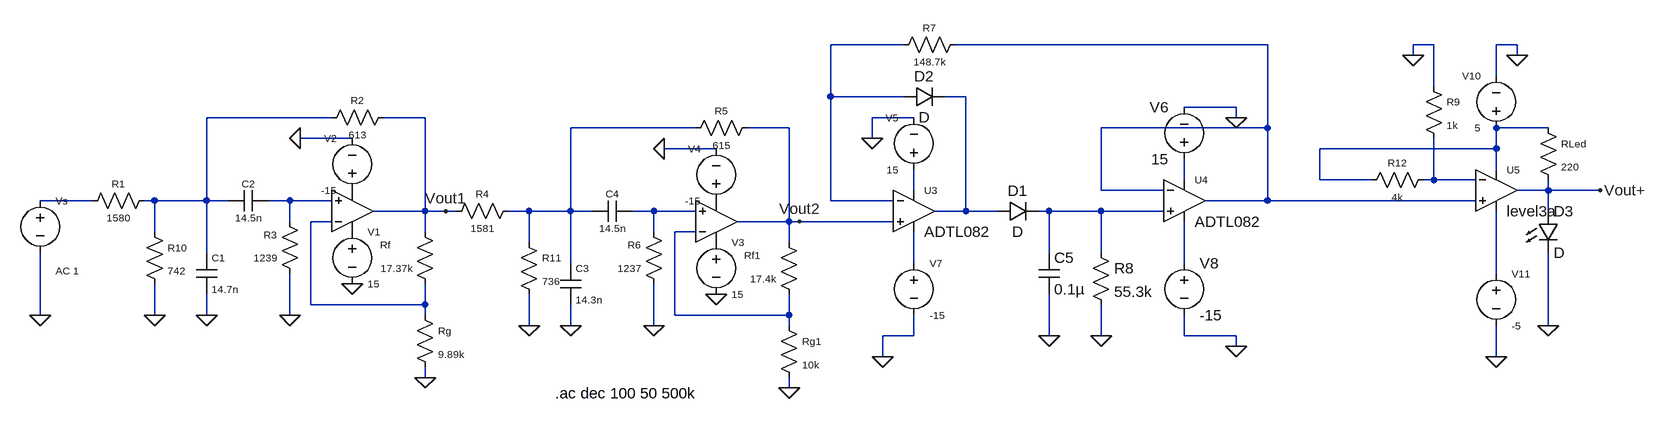
[diagram p0: schematic Bandpass Sallen Key lab 17kHz 2 stage with all stage vd fixed.asc]
Bandpass Sallen Key lab 17kHz 2 stage with all stage vd fixed.asc, the LTspice schematic file:
Version 4.1
SHEET 1 2168 980
WIRE 1008 -112 896 -112
WIRE 1568 -112 1088 -112
WIRE 1824 -112 1792 -112
WIRE 1952 -112 1920 -112
WIRE 1792 -96 1792 -112
WIRE 1952 -96 1952 -112
WIRE 1920 -64 1920 -112
WIRE 1824 -48 1824 -112
WIRE 896 -32 896 -112
WIRE 1008 -32 896 -32
WIRE 1104 -32 1072 -32
WIRE 1520 -16 1440 -16
WIRE 128 0 -64 0
WIRE 272 0 208 0
WIRE 1024 0 960 0
WIRE 1520 0 1520 -16
WIRE 688 16 496 16
WIRE 832 16 768 16
WIRE 1568 16 1568 -112
WIRE 1568 16 1312 16
WIRE 2000 16 1920 16
WIRE 160 32 80 32
WIRE 960 32 960 0
WIRE 720 48 640 48
WIRE 1920 48 1920 16
WIRE 1920 48 1648 48
WIRE 1920 80 1920 48
WIRE 1440 96 1440 64
WIRE 1648 96 1648 48
WIRE 1728 96 1648 96
WIRE 1824 96 1824 32
WIRE 1824 96 1808 96
WIRE 1888 96 1824 96
WIRE 1024 112 1024 80
WIRE 1312 112 1312 16
WIRE 1408 112 1312 112
WIRE 2000 112 2000 96
WIRE 2000 112 1952 112
WIRE 2080 112 2000 112
WIRE -240 128 -320 128
WIRE -144 128 -160 128
WIRE -64 128 -64 0
WIRE -64 128 -144 128
WIRE -32 128 -64 128
WIRE 64 128 32 128
WIRE 128 128 64 128
WIRE 896 128 896 -32
WIRE 992 128 896 128
WIRE 1568 128 1568 16
WIRE 1568 128 1472 128
WIRE 1888 128 1568 128
WIRE 272 144 272 0
WIRE 272 144 192 144
WIRE 304 144 272 144
WIRE 320 144 304 144
WIRE 432 144 400 144
WIRE 496 144 496 16
WIRE 496 144 432 144
WIRE 528 144 496 144
WIRE 624 144 592 144
WIRE 688 144 624 144
WIRE 1104 144 1104 -32
WIRE 1104 144 1056 144
WIRE 1152 144 1104 144
WIRE 1232 144 1216 144
WIRE 1312 144 1232 144
WIRE 1408 144 1312 144
WIRE 2000 144 2000 112
WIRE 64 160 64 128
WIRE 128 160 96 160
WIRE 832 160 832 16
WIRE 832 160 752 160
WIRE 848 160 832 160
WIRE 992 160 848 160
WIRE -144 176 -144 128
WIRE 272 176 272 144
WIRE 624 176 624 144
WIRE 688 176 656 176
WIRE 432 192 432 144
WIRE 832 192 832 160
WIRE -64 208 -64 128
WIRE 1232 208 1232 144
WIRE 1312 208 1312 144
WIRE 496 224 496 144
WIRE 1024 224 1024 176
WIRE 1440 224 1440 160
WIRE 1920 240 1920 144
WIRE 96 288 96 160
WIRE 272 288 272 256
WIRE 272 288 96 288
WIRE -320 304 -320 208
WIRE -144 304 -144 256
WIRE -64 304 -64 272
WIRE 64 304 64 240
WIRE 272 304 272 288
WIRE 656 304 656 176
WIRE 832 304 832 272
WIRE 832 304 656 304
WIRE 432 320 432 272
WIRE 496 320 496 288
WIRE 624 320 624 256
WIRE 832 320 832 304
WIRE 2000 320 2000 208
WIRE 1024 336 1024 304
WIRE 1024 336 976 336
WIRE 1232 336 1232 272
WIRE 1312 336 1312 288
WIRE 1440 336 1440 304
WIRE 1520 336 1440 336
WIRE 1520 352 1520 336
WIRE 976 368 976 336
WIRE 1920 368 1920 320
WIRE 272 400 272 384
WIRE 832 416 832 400
FLAG -64 304 0
FLAG 64 304 0
FLAG 272 400 0
FLAG -320 304 0
FLAG 304 144 Vout1
FLAG 160 256 0
FLAG 80 32 0
FLAG 496 320 0
FLAG 624 320 0
FLAG 832 416 0
FLAG 720 272 0
FLAG 640 48 0
FLAG 848 160 Vout2
FLAG -144 304 0
FLAG 432 320 0
FLAG 1232 336 0
FLAG 1312 336 0
FLAG 960 32 0
FLAG 976 368 0
FLAG 1520 0 0
FLAG 1520 352 0
FLAG 1792 -96 0
FLAG 1952 -96 0
FLAG 1920 368 0
FLAG 2000 320 0
FLAG 2080 112 Vout+
SYMBOL OpAmps\\UniversalOpAmp2 160 144 M180
WINDOW 0 16 -32 Invisible 1
SYMATTR InstName U1
SYMBOL res 224 -16 R90
WINDOW 0 0 56 VBottom 1
WINDOW 3 32 56 VTop 1
SYMATTR InstName R2
SYMATTR Value 613
SYMBOL res -144 112 R90
WINDOW 0 0 56 VBottom 1
WINDOW 3 32 56 VTop 1
SYMATTR InstName R1
SYMATTR Value 1580
SYMBOL res 80 256 R180
WINDOW 0 36 76 Left 1
WINDOW 3 36 40 Left 1
SYMATTR InstName R3
SYMATTR Value 1239
SYMBOL res 288 272 R180
WINDOW 0 85 76 Right 1
WINDOW 3 36 40 Left 1
SYMATTR InstName Rf
SYMATTR Value 17.37k
SYMBOL res 256 288 R0
WINDOW 0 36 40 Left 1
WINDOW 3 36 76 Left 1
SYMATTR InstName Rg
SYMATTR Value 9.89k
SYMBOL cap -80 208 R0
WINDOW 0 24 8 Left 1
WINDOW 3 24 56 Left 1
SYMATTR InstName C1
SYMATTR Value 14.7n
SYMBOL cap 32 112 R90
WINDOW 0 0 32 VBottom 1
WINDOW 3 32 32 VTop 1
SYMATTR InstName C2
SYMATTR Value 14.5n
SYMBOL voltage -320 112 R0
WINDOW 0 24 16 Left 1
WINDOW 123 24 124 Left 1
WINDOW 39 0 0 Left 0
SYMATTR InstName Vs
SYMATTR Value2 AC 1
SYMATTR Value ""
SYMBOL voltage 160 160 R0
WINDOW 0 24 16 Left 1
WINDOW 3 24 96 Left 1
WINDOW 123 0 0 Left 0
WINDOW 39 0 0 Left 0
SYMATTR InstName V1
SYMATTR Value 15
SYMBOL voltage 160 128 R180
WINDOW 0 24 96 Left 1
WINDOW 3 24 16 Left 1
WINDOW 123 0 0 Left 0
WINDOW 39 0 0 Left 0
SYMATTR InstName V2
SYMATTR Value -15
SYMBOL OpAmps\\UniversalOpAmp2 720 160 M180
WINDOW 0 16 -32 Invisible 1
SYMATTR InstName U2
SYMBOL res 416 128 R90
WINDOW 0 0 56 VBottom 1
WINDOW 3 32 56 VTop 1
SYMATTR InstName R4
SYMATTR Value 1581
SYMBOL res 640 272 R180
WINDOW 0 36 76 Left 1
WINDOW 3 36 40 Left 1
SYMATTR InstName R6
SYMATTR Value 1237
SYMBOL res 848 288 R180
WINDOW 0 85 76 Right 1
WINDOW 3 36 40 Left 1
SYMATTR InstName Rf1
SYMATTR Value 17.4k
SYMBOL res 816 304 R0
WINDOW 0 36 40 Left 1
WINDOW 3 36 76 Left 1
SYMATTR InstName Rg1
SYMATTR Value 10k
SYMBOL cap 480 224 R0
WINDOW 0 24 8 Left 1
WINDOW 3 24 56 Left 1
SYMATTR InstName C3
SYMATTR Value 14.3n
SYMBOL cap 592 128 R90
WINDOW 0 0 32 VBottom 1
WINDOW 3 32 32 VTop 1
SYMATTR InstName C4
SYMATTR Value 14.5n
SYMBOL voltage 720 176 R0
WINDOW 0 24 16 Left 1
WINDOW 3 24 96 Left 1
WINDOW 123 0 0 Left 0
WINDOW 39 0 0 Left 0
SYMATTR InstName V3
SYMATTR Value 15
SYMBOL voltage 720 144 R180
WINDOW 0 24 96 Left 1
WINDOW 3 24 16 Left 1
WINDOW 123 0 0 Left 0
WINDOW 39 0 0 Left 0
SYMATTR InstName V4
SYMATTR Value -15
SYMBOL res -160 160 R0
WINDOW 0 36 40 Left 1
WINDOW 3 36 76 Left 1
SYMATTR InstName R10
SYMATTR Value 742
SYMBOL res 416 176 R0
WINDOW 0 36 40 Left 1
WINDOW 3 36 76 Left 1
SYMATTR InstName R11
SYMATTR Value 736
SYMBOL OpAmps\\ADTL082 1024 80 R0
WINDOW 0 16 32 Left 1
SYMATTR InstName U3
SYMBOL res 784 0 R90
WINDOW 0 0 56 VBottom 1
WINDOW 3 32 56 VTop 1
SYMATTR InstName R5
SYMATTR Value 615
SYMBOL res 1104 -128 R90
WINDOW 0 0 56 VBottom 1
WINDOW 3 32 56 VTop 1
SYMATTR InstName R7
SYMATTR Value 148.7k
SYMBOL diode 1008 -16 R270
WINDOW 0 32 32 VTop 2
WINDOW 3 0 32 VBottom 2
SYMATTR InstName D2
SYMBOL diode 1152 160 R270
WINDOW 0 32 32 VTop 2
WINDOW 3 0 32 VBottom 2
SYMATTR InstName D1
SYMBOL OpAmps\\ADTL082 1440 64 R0
WINDOW 0 16 32 Left 1
SYMATTR InstName U4
SYMBOL cap 1216 208 R0
SYMATTR InstName C5
SYMATTR Value 0.1µ
SYMBOL res 1296 192 R0
SYMATTR InstName R8
SYMATTR Value 55.3k
SYMBOL voltage 1024 96 R180
WINDOW 0 24 96 Left 1
WINDOW 3 24 16 Left 1
SYMATTR InstName V5
SYMATTR Value 15
SYMBOL voltage 1440 80 R180
WINDOW 0 24 96 Left 2
WINDOW 3 24 16 Left 2
SYMATTR InstName V6
SYMATTR Value 15
SYMBOL voltage 1024 208 R0
WINDOW 0 24 16 Left 1
WINDOW 3 24 96 Left 1
SYMATTR InstName V7
SYMATTR Value -15
SYMBOL voltage 1440 208 R0
SYMATTR InstName V8
SYMATTR Value -15
SYMBOL OpAmps\\UniversalOpAmp3 1920 112 R0
WINDOW 0 16 -32 Left 1
SYMATTR InstName U5
SYMBOL res 1808 -64 R0
WINDOW 0 36 40 Left 1
WINDOW 3 36 76 Left 1
SYMATTR InstName R9
SYMATTR Value 1k
SYMBOL res 1824 80 R90
WINDOW 0 0 56 VBottom 1
WINDOW 3 32 56 VTop 1
SYMATTR InstName R12
SYMATTR Value 4k
SYMBOL voltage 1920 32 R180
WINDOW 0 24 96 Left 1
WINDOW 3 24 16 Left 1
WINDOW 123 0 0 Left 0
WINDOW 39 24 68 Left 1
SYMATTR InstName V10
SYMATTR Value 5
SYMBOL voltage 1920 224 R0
WINDOW 0 24 16 Left 1
WINDOW 3 24 96 Left 1
SYMATTR InstName V11
SYMATTR Value -5
SYMBOL res 1984 0 R0
WINDOW 0 36 40 Left 1
WINDOW 3 36 76 Left 1
SYMATTR InstName RLed
SYMATTR Value 220
SYMBOL LED 1984 144 R0
SYMATTR InstName D3
TEXT 472 424 Left 2 !.ac dec 100 50 500k

The netlist it stands for:
* Bandpass Sallen Key lab 17kHz 2 stage with all stage vd fixed.asc
X§U1 N011 N014 P001 P002 Vout1 level2 Avol=1Meg GBW=10Meg Slew=10Meg Ilimit=25m Rail=0 Vos=0 En=0 Enk=0 In=0 Ink=0 Rin=500Meg  ; pins In+ In- V+ V- OUT
R2 Vout1 N004 613
R1 N004 N010 1580
R3 0 N011 1239
Rf N014 Vout1 17.37k
Rg N014 0 9.89k
C1 N004 0 14.7n
C2 N011 N004 14.5n
Vs N010 0 AC 1
V1 P001 0 15
V2 P002 0 -15
X§U2 N012 N015 P003 P004 Vout2 level2 Avol=1Meg GBW=10Meg Slew=10Meg Ilimit=25m Rail=0 Vos=0 En=0 Enk=0 In=0 Ink=0 Rin=500Meg  ; pins In+ In- V+ V- OUT
R4 N005 Vout1 1581
R6 0 N012 1237
Rf1 N015 Vout2 17.4k
Rg1 N015 0 10k
C3 N005 0 14.3n
C4 N012 N005 14.5n
V3 P003 0 15
V4 P004 0 -15
R10 N004 0 742
R11 N005 0 736
X§U3 Vout2 N001 N009 N016 N003 ADTL082  ; pins In+ In- V+ V- OUT
R5 Vout2 N005 615
R7 N002 N001 148.7k
D2 N001 N003 D
D1 N003 N013 D
X§U4 N013 N002 N007 N017 N002 ADTL082  ; pins In+ In- V+ V- OUT
C5 N013 0 0.1µ
R8 N013 0 55.3k
V5 N009 0 15
V6 N007 0 15
V7 N016 0 -15
V8 N017 0 -15
X§U5 N002 N008 N006 N018 Vout+ level3a  ; pins In+ In- V+ V- OUT
R9 0 N008 1k
R12 N008 N006 4k
V10 N006 0 5
V11 N018 0 -5
RLed N006 Vout+ 220
D3 Vout+ 0 D
.model D D
.lib standard.dio
.ac dec 100 50 500k
.lib UniversalOpAmp2.lib
.lib ADI.lib
.backanno
.end